# EAGLE design led_pcb (EAGLE 9.1.2)
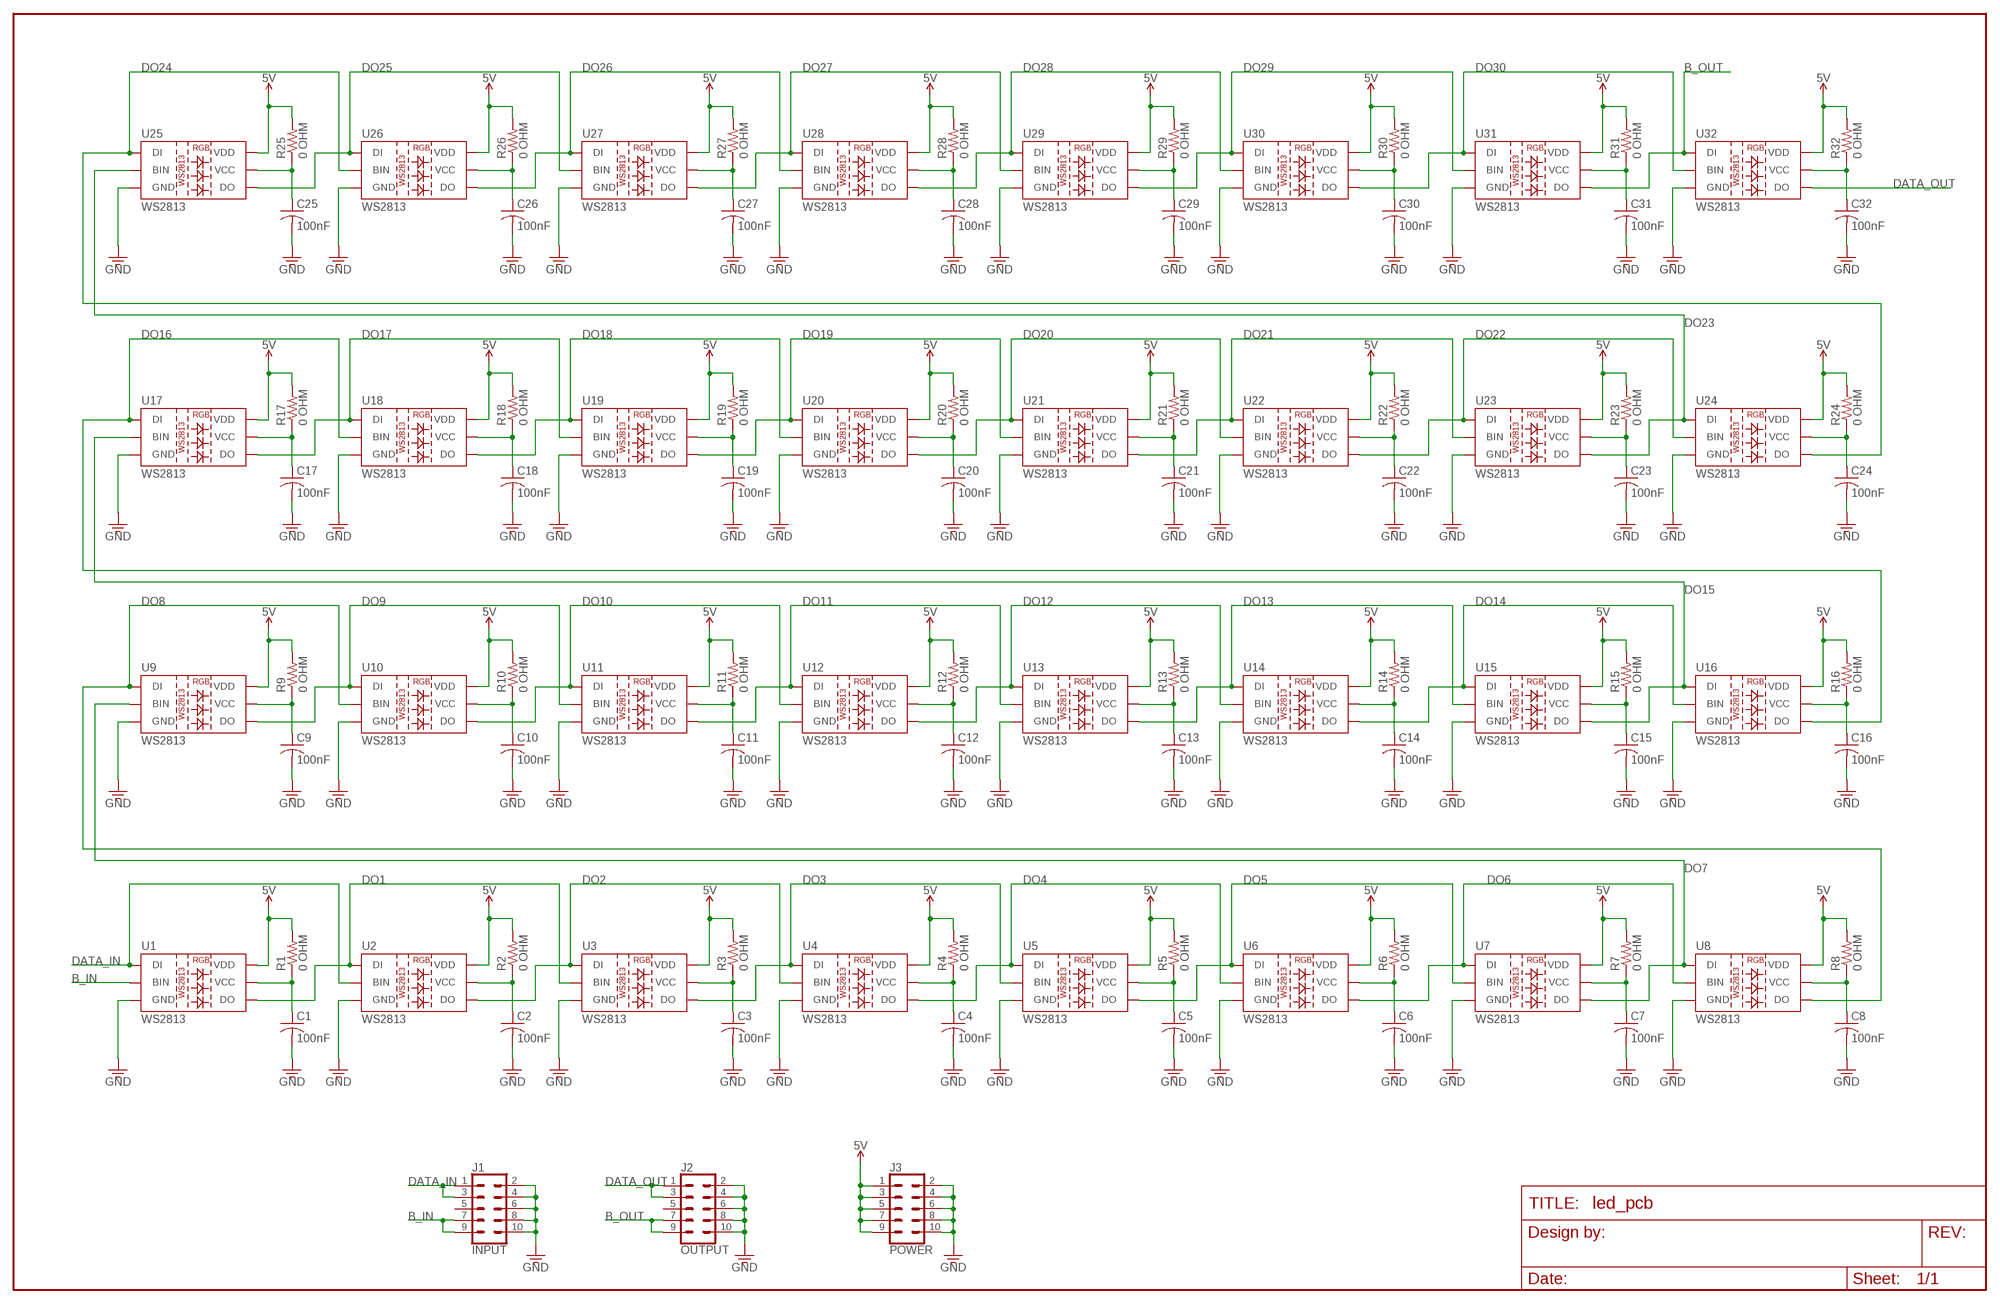
[diagram p0: schematic, sheet 1]

## Parts
C1  100nF  C-USC0805K  [C0805K]
C2  100nF  C-USC0805K  [C0805K]
C3  100nF  C-USC0805K  [C0805K]
C4  100nF  C-USC0805K  [C0805K]
C5  100nF  C-USC0805K  [C0805K]
C6  100nF  C-USC0805K  [C0805K]
C7  100nF  C-USC0805K  [C0805K]
C8  100nF  C-USC0805K  [C0805K]
C9  100nF  C-USC0805K  [C0805K]
C10  100nF  C-USC0805K  [C0805K]
C11  100nF  C-USC0805K  [C0805K]
C12  100nF  C-USC0805K  [C0805K]
C13  100nF  C-USC0805K  [C0805K]
C14  100nF  C-USC0805K  [C0805K]
C15  100nF  C-USC0805K  [C0805K]
C16  100nF  C-USC0805K  [C0805K]
C17  100nF  C-USC0805K  [C0805K]
C18  100nF  C-USC0805K  [C0805K]
C19  100nF  C-USC0805K  [C0805K]
C20  100nF  C-USC0805K  [C0805K]
C21  100nF  C-USC0805K  [C0805K]
C22  100nF  C-USC0805K  [C0805K]
C23  100nF  C-USC0805K  [C0805K]
C24  100nF  C-USC0805K  [C0805K]
C25  100nF  C-USC0805K  [C0805K]
C26  100nF  C-USC0805K  [C0805K]
C27  100nF  C-USC0805K  [C0805K]
C28  100nF  C-USC0805K  [C0805K]
C29  100nF  C-USC0805K  [C0805K]
C30  100nF  C-USC0805K  [C0805K]
C31  100nF  C-USC0805K  [C0805K]
C32  100nF  C-USC0805K  [C0805K]
J1  INPUT  CONN_05X2SHD_SMD  [2X5-SHROUDED_SMD]
J2  OUTPUT  CONN_05X2SHD_SMD  [2X5-SHROUDED_SMD]
J3  POWER  CONN_05X2SHD_SMD  [2X5-SHROUDED_SMD]
R1  0 OHM  R-US_M0805  [M0805]
R2  0 OHM  R-US_M0805  [M0805]
R3  0 OHM  R-US_M0805  [M0805]
R4  0 OHM  R-US_M0805  [M0805]
R5  0 OHM  R-US_M0805  [M0805]
R6  0 OHM  R-US_M0805  [M0805]
R7  0 OHM  R-US_M0805  [M0805]
R8  0 OHM  R-US_M0805  [M0805]
R9  0 OHM  R-US_M0805  [M0805]
R10  0 OHM  R-US_M0805  [M0805]
R11  0 OHM  R-US_M0805  [M0805]
R12  0 OHM  R-US_M0805  [M0805]
R13  0 OHM  R-US_M0805  [M0805]
R14  0 OHM  R-US_M0805  [M0805]
R15  0 OHM  R-US_M0805  [M0805]
R16  0 OHM  R-US_M0805  [M0805]
R17  0 OHM  R-US_M0805  [M0805]
R18  0 OHM  R-US_M0805  [M0805]
R19  0 OHM  R-US_M0805  [M0805]
R20  0 OHM  R-US_M0805  [M0805]
R21  0 OHM  R-US_M0805  [M0805]
R22  0 OHM  R-US_M0805  [M0805]
R23  0 OHM  R-US_M0805  [M0805]
R24  0 OHM  R-US_M0805  [M0805]
R25  0 OHM  R-US_M0805  [M0805]
R26  0 OHM  R-US_M0805  [M0805]
R27  0 OHM  R-US_M0805  [M0805]
R28  0 OHM  R-US_M0805  [M0805]
R29  0 OHM  R-US_M0805  [M0805]
R30  0 OHM  R-US_M0805  [M0805]
R31  0 OHM  R-US_M0805  [M0805]
R32  0 OHM  R-US_M0805  [M0805]
U1  WS2813  [WS2813]
U2  WS2813  [WS2813]
U3  WS2813  [WS2813]
U4  WS2813  [WS2813]
U5  WS2813  [WS2813]
U6  WS2813  [WS2813]
U7  WS2813  [WS2813]
U8  WS2813  [WS2813]
U9  WS2813  [WS2813]
U10  WS2813  [WS2813]
U11  WS2813  [WS2813]
U12  WS2813  [WS2813]
U13  WS2813  [WS2813]
U14  WS2813  [WS2813]
U15  WS2813  [WS2813]
U16  WS2813  [WS2813]
U17  WS2813  [WS2813]
U18  WS2813  [WS2813]
U19  WS2813  [WS2813]
U20  WS2813  [WS2813]
U21  WS2813  [WS2813]
U22  WS2813  [WS2813]
U23  WS2813  [WS2813]
U24  WS2813  [WS2813]
U25  WS2813  [WS2813]
U26  WS2813  [WS2813]
U27  WS2813  [WS2813]
U28  WS2813  [WS2813]
U29  WS2813  [WS2813]
U30  WS2813  [WS2813]
U31  WS2813  [WS2813]
U32  WS2813  [WS2813]

## Nets
5V: J3.1 J3.3 J3.5 J3.7 J3.9 R1.2 R2.2 R3.2 R4.2 R5.2 R6.2 R7.2 R8.2 R9.2 R10.2 R11.2 R12.2 R13.2 R14.2 R15.2 R16.2 R17.2 R18.2 R19.2 R20.2 R21.2 R22.2 R23.2 R24.2 R25.2 R26.2 R27.2 R28.2 R29.2 R30.2 R31.2 R32.2 U1.2(VDD) U2.2(VDD) U3.2(VDD) U4.2(VDD) U5.2(VDD) U6.2(VDD) U7.2(VDD) U8.2(VDD) U9.2(VDD) U10.2(VDD) U11.2(VDD) U12.2(VDD) U13.2(VDD) U14.2(VDD) U15.2(VDD) U16.2(VDD) U17.2(VDD) U18.2(VDD) U19.2(VDD) U20.2(VDD) U21.2(VDD) U22.2(VDD) U23.2(VDD) U24.2(VDD) U25.2(VDD) U26.2(VDD) U27.2(VDD) U28.2(VDD) U29.2(VDD) U30.2(VDD) U31.2(VDD) U32.2(VDD)
B_IN: J1.7 J1.9 U1.6(BIN)
B_OUT: J2.7 J2.9 U31.3(DO) U32.4(DI)
DATA_IN: J1.1 J1.3 U1.4(DI) U2.6(BIN)
DATA_OUT: J2.1 J2.3 U32.3(DO)
DO1: U1.3(DO) U2.4(DI) U3.6(BIN)
DO2: U2.3(DO) U3.4(DI) U4.6(BIN)
DO3: U3.3(DO) U4.4(DI) U5.6(BIN)
DO4: U4.3(DO) U5.4(DI) U6.6(BIN)
DO5: U5.3(DO) U6.4(DI) U7.6(BIN)
DO6: U6.3(DO) U7.4(DI) U8.6(BIN)
DO7: U7.3(DO) U8.4(DI) U9.6(BIN)
DO8: U8.3(DO) U9.4(DI) U10.6(BIN)
DO9: U9.3(DO) U10.4(DI) U11.6(BIN)
DO10: U10.3(DO) U11.4(DI) U12.6(BIN)
DO11: U11.3(DO) U12.4(DI) U13.6(BIN)
DO12: U12.3(DO) U13.4(DI) U14.6(BIN)
DO13: U13.3(DO) U14.4(DI) U15.6(BIN)
DO14: U14.3(DO) U15.4(DI) U16.6(BIN)
DO15: U15.3(DO) U16.4(DI) U17.6(BIN)
DO16: U16.3(DO) U17.4(DI) U18.6(BIN)
DO17: U17.3(DO) U18.4(DI) U19.6(BIN)
DO18: U18.3(DO) U19.4(DI) U20.6(BIN)
DO19: U19.3(DO) U20.4(DI) U21.6(BIN)
DO20: U20.3(DO) U21.4(DI) U22.6(BIN)
DO21: U21.3(DO) U22.4(DI) U23.6(BIN)
DO22: U22.3(DO) U23.4(DI) U24.6(BIN)
DO23: U23.3(DO) U24.4(DI) U25.6(BIN)
DO24: U24.3(DO) U25.4(DI) U26.6(BIN)
DO25: U25.3(DO) U26.4(DI) U27.6(BIN)
DO26: U26.3(DO) U27.4(DI) U28.6(BIN)
DO27: U27.3(DO) U28.4(DI) U29.6(BIN)
DO28: U28.3(DO) U29.4(DI) U30.6(BIN)
DO29: U29.3(DO) U30.4(DI) U31.6(BIN)
DO30: U30.3(DO) U31.4(DI) U32.6(BIN)
GND: C1.2 C2.2 C3.2 C4.2 C5.2 C6.2 C7.2 C8.2 C9.2 C10.2 C11.2 C12.2 C13.2 C14.2 C15.2 C16.2 C17.2 C18.2 C19.2 C20.2 C21.2 C22.2 C23.2 C24.2 C25.2 C26.2 C27.2 C28.2 C29.2 C30.2 C31.2 C32.2 J1.2 J1.4 J1.6 J1.8 J1.10 J2.2 J2.4 J2.6 J2.8 J2.10 J3.2 J3.4 J3.6 J3.8 J3.10 U1.5(GND) U2.5(GND) U3.5(GND) U4.5(GND) U5.5(GND) U6.5(GND) U7.5(GND) U8.5(GND) U9.5(GND) U10.5(GND) U11.5(GND) U12.5(GND) U13.5(GND) U14.5(GND) U15.5(GND) U16.5(GND) U17.5(GND) U18.5(GND) U19.5(GND) U20.5(GND) U21.5(GND) U22.5(GND) U23.5(GND) U24.5(GND) U25.5(GND) U26.5(GND) U27.5(GND) U28.5(GND) U29.5(GND) U30.5(GND) U31.5(GND) U32.5(GND)
N$1: C1.1 R1.1 U1.1(VCC)
N$3: C2.1 R2.1 U2.1(VCC)
N$5: C3.1 R3.1 U3.1(VCC)
N$7: C4.1 R4.1 U4.1(VCC)
N$9: C5.1 R5.1 U5.1(VCC)
N$11: C6.1 R6.1 U6.1(VCC)
N$13: C7.1 R7.1 U7.1(VCC)
N$15: C8.1 R8.1 U8.1(VCC)
N$18: C17.1 R17.1 U17.1(VCC)
N$19: C18.1 R18.1 U18.1(VCC)
N$21: C19.1 R19.1 U19.1(VCC)
N$23: C9.1 R9.1 U9.1(VCC)
N$24: C10.1 R10.1 U10.1(VCC)
N$26: C11.1 R11.1 U11.1(VCC)
N$28: C12.1 R12.1 U12.1(VCC)
N$30: C13.1 R13.1 U13.1(VCC)
N$32: C14.1 R14.1 U14.1(VCC)
N$34: C15.1 R15.1 U15.1(VCC)
N$36: C16.1 R16.1 U16.1(VCC)
N$38: C20.1 R20.1 U20.1(VCC)
N$40: C21.1 R21.1 U21.1(VCC)
N$42: C22.1 R22.1 U22.1(VCC)
N$44: C23.1 R23.1 U23.1(VCC)
N$46: C24.1 R24.1 U24.1(VCC)
N$48: C25.1 R25.1 U25.1(VCC)
N$49: C26.1 R26.1 U26.1(VCC)
N$51: C27.1 R27.1 U27.1(VCC)
N$53: C28.1 R28.1 U28.1(VCC)
N$55: C29.1 R29.1 U29.1(VCC)
N$57: C30.1 R30.1 U30.1(VCC)
N$59: C31.1 R31.1 U31.1(VCC)
N$61: C32.1 R32.1 U32.1(VCC)
Unconnected: J1.5 J2.5

## Library data of the parts
C1-C32 = rcl:C-US: CAPACITOR, American symbol; SPICEPREFIX: C
J1-J3 = kala_lib:CONN_05X2: Multi connection point. Often used as Generic Header-pin footprint for 0.1 inch spaced/style header connections For AVR SPI programming port, see special device with nice symbol: "AVR_SPI_PROG_5x2.dev" You can populate with any combo of single row headers, but if you'd like an exact match, check these: 2x5 AVR ICSP Male Header <https://www.sparkfun.com/products/778> (PRT-00778) 2x5 Pin Shrouded Header <https://www.sparkfun.com/products/8506> (PRT-08506) On any of the 0.1 inch spaced packages, you can populate with these: Break Away Headers - Straight <https://www.sparkfun.com/products/116> (PRT-00116) Break Away Male Headers - Right Angle <https://www.sparkfun.com/products/553> (PRT-00553) Female Headers <https://www.sparkfun.com/products/115> (PRT-00115) Break Away Headers - Machine Pin <https://www.sparkfun.com/products/117> (PRT-00117) Break Away Female Headers - Swiss Machine Pin <https://www.sparkfun.com/products/743> (PRT-00743) Special note: the shrouded connector mates well with our 5x2 ribbon cables: 2x5 Pin IDC Ribbon Cable <https://www.sparkfun.com/products/8535> (PRT-08535); PROD_ID: CONN-09508
R1-R32 = resistor:R-US_: RESISTOR, American symbol
U1-U32 = kala_lib:WS2813: WS2813 RGB LED

## Board
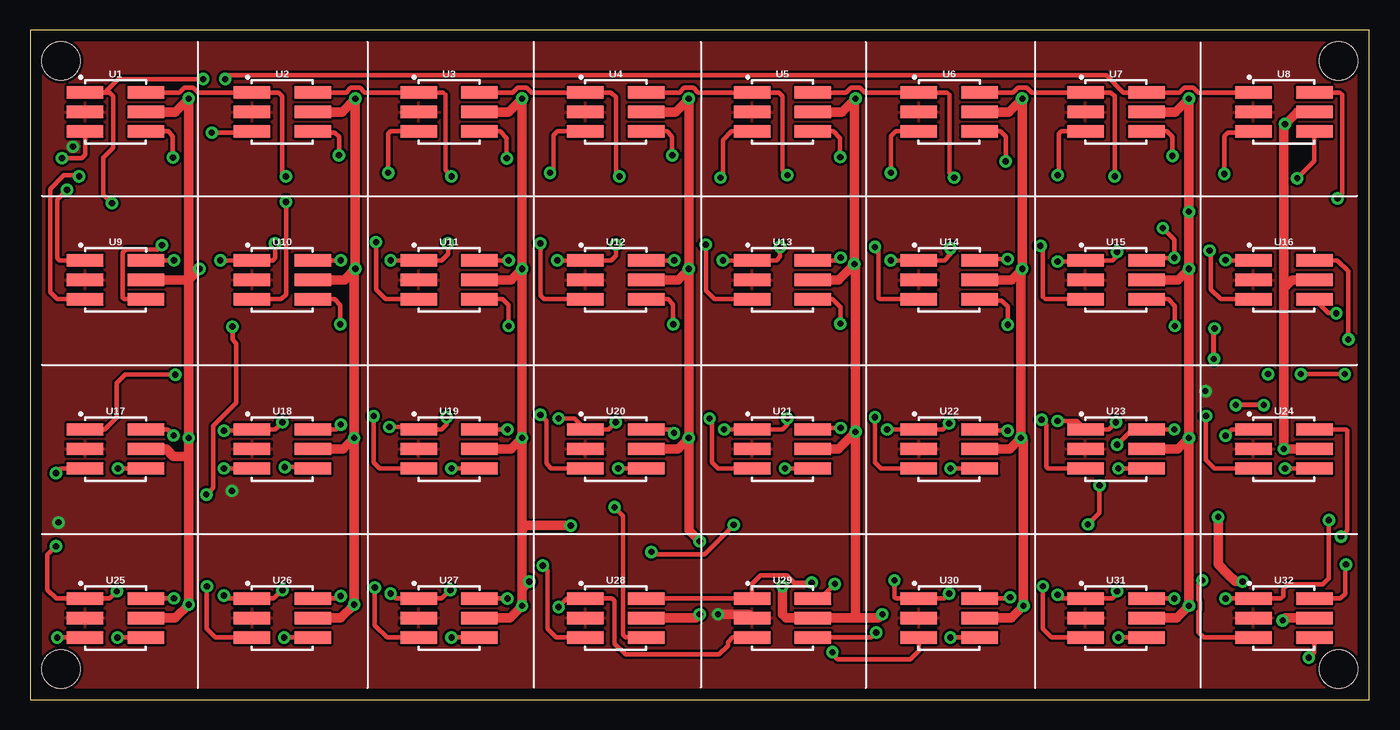
[diagram p1: board, top side]
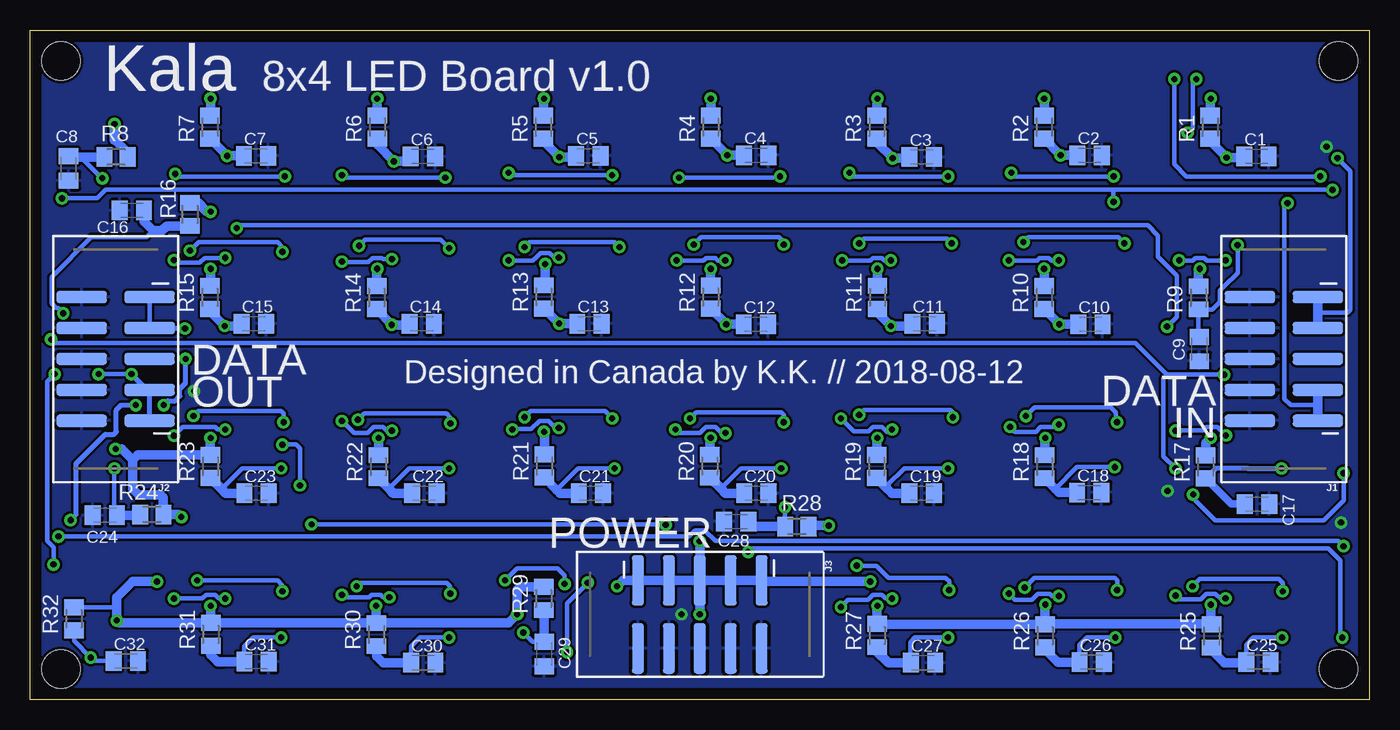
[diagram p2: board, bottom side, seen from below]

Size 110 x 55 mm. Coordinates in mm from the lower left corner, seen from the top.
Outline: 0,0 110,0 110,55 0,55 0,0
Copper layers (1*16): Top 0.035mm / dielectric 1.5mm / Bottom 0.035mm
Design rules "kala": minimum track width 8mil, minimum drill 20mil, track to track 8mil, track to pad 8mil, pad to pad 8mil, via to via 8mil, smd to smd 8mil, copper to edge 10mil, drill to drill 8mil, minimum pad ring 12mil, minimum via ring 10mil, stop-mask expansion 4mil, vias tented up to drill 25mil, thermal gap 10mil
Holes 3.15 mm at 2.5,52.5 107.5,52.5 107.5,2.5 2.5,2.5

### Footprints (pad centres in the part's own frame; a part is rotated, then mirrored left to right if it is on the bottom)
C0805K = smd 1.3 x 1.6: 1 -1,0; 2 1,0
2X5-SHROUDED_SMD = smd 4.15 x 1: 1 -2.794,5.08; 2 2.794,5.08; 3 -2.794,2.54; 4 2.794,2.54; 5 -2.794,0; 6 2.794,0; 7 -2.794,-2.54; 8 2.794,-2.54; 9 -2.794,-5.08; 10 2.794,-5.08
M0805 = smd 1.3 x 1.6: 1 -0.95,0; 2 0.95,0
WS2813 = smd 3 x 1: 1 2.5,-1.6; 2 2.5,-0.001; 3 2.5,1.6; 4 -2.5,1.6; 5 -2.5,-0.001; 6 -2.5,-1.6

### Placement (x,y rotation side)
C1  9.26,44.65 0 bottom
C2  22.96,44.74 0 bottom
C3  36.76,44.59 0 bottom
C4  50.36,44.74 0 bottom
C5  64.16,44.69 0 bottom
C6  77.76,44.64 0 bottom
C7  91.46,44.69 0 bottom
C8  106.86,43.66 270 bottom
C9  13.95,28.81 270 bottom
C10  22.9,30.85 0 bottom
C11  36.52,30.9 0 bottom
C12  50.39,30.85 0 bottom
C13  64.06,30.9 0 bottom
C14  77.85,30.9 0 bottom
C15  91.64,30.9 0 bottom
C16  101.67,40.2 180 bottom
C17  9.2,16.06 0 bottom
C18  22.99,17.01 0 bottom
C19  36.76,16.96 0 bottom
C20  50.35,16.96 0 bottom
C21  63.94,16.96 0 bottom
C22  77.63,16.96 0 bottom
C23  91.42,16.96 0 bottom
C24  103.89,15.14 180 bottom
C25  9.1,3.07 0 bottom
C26  22.79,3.07 0 bottom
C27  36.66,3.02 0 bottom
C28  52,14.63 180 bottom
C29  67.78,3.74 270 bottom
C30  77.73,3.02 0 bottom
C31  91.42,3.12 0 bottom
C32  102.16,3.17 0 bottom
J1  7,28 180 bottom
J2  103,28 180 bottom
J3  55,7 270 bottom
R1  13.05,47.04 90 bottom
R2  26.7,47.04 90 bottom
R3  40.44,47.04 90 bottom
R4  54.09,47.04 90 bottom
R5  67.84,47.04 90 bottom
R6  81.49,47.04 90 bottom
R7  95.24,47.04 90 bottom
R8  102.96,44.59 0 bottom
R9  14.02,33.02 90 bottom
R10  26.7,33.04 90 bottom
R11  40.4,33.06 90 bottom
R12  54.1,33.08 90 bottom
R13  67.8,33.1 90 bottom
R14  81.55,33.04 90 bottom
R15  95.25,33.06 90 bottom
R16  96.9,39.88 90 bottom
R17  13.43,19.12 90 bottom
R18  26.66,19.14 90 bottom
R19  40.46,19.16 90 bottom
R20  54.16,19.18 90 bottom
R21  67.76,19.2 90 bottom
R22  81.41,19.14 90 bottom
R23  95.21,19.16 90 bottom
R24  100.02,15.21 0 bottom
R25  12.94,5.22 90 bottom
R26  26.62,5.24 90 bottom
R27  40.42,5.26 90 bottom
R28  47.02,14.22 0 bottom
R29  67.82,8.3 90 bottom
R30  81.57,5.34 90 bottom
R31  95.17,5.36 90 bottom
R32  106.42,6.63 90 bottom
U1  7,48.3 0 top
U2  20.7,48.3 0 top
U3  34.4,48.3 0 top
U4  48.1,48.3 0 top
U5  61.8,48.3 0 top
U6  75.5,48.3 0 top
U7  89.2,48.3 0 top
U8  103,48.3 0 top
U9  7,34.5 0 top
U10  20.7,34.5 0 top
U11  34.4,34.5 0 top
U12  48.1,34.5 0 top
U13  61.8,34.5 0 top
U14  75.5,34.5 0 top
U15  89.2,34.5 0 top
U16  103,34.5 0 top
U17  7,20.6 0 top
U18  20.7,20.6 0 top
U19  34.4,20.6 0 top
U20  48.1,20.6 0 top
U21  61.8,20.6 0 top
U22  75.5,20.6 0 top
U23  89.2,20.6 0 top
U24  103,20.6 0 top
U25  7,6.7 0 top
U26  20.7,6.7 0 top
U27  34.4,6.7 0 top
U28  48.1,6.7 0 top
U29  61.8,6.7 0 top
U30  75.5,6.7 0 top
U31  89.2,6.7 0 top
U32  103,6.7 0 top

### Tracks (layer width: path | path; a pad name or v marks a point on that pad's centre or on a via)
5V  (via drill 0.51)
  Top 0.762: U26.2 25.5,6.7 v26.6,7.8 v26.6,21.5 | U27.2 39.4,6.7 v40.4,7.7 40.4,9.1 | U25.2 11.9,6.7 v13,7.8 13,20 | U28.2 54.7,6.7 v55,7 | 40.4,9.1 v41,9.7 | U18.2 25.7,20.6 v26.6,21.5 | U19.2 39.5,20.6 v40.4,21.5 | U20.2 53.2,20.6 v54.1,21.5 | U21.2 66.4,20.6 v67.8,22 | U22.2 80.5,20.6 v81.4,21.5 | U23.2 94.3,20.6 v95.2,21.5 | 68,6.7 U29.2 62.1,6.7 61.8,7 v61.8,9.3 | 68,6.7 69.7,6.7 v70,7 | U30.2 80.6,6.7 v81.6,7.7 81.6,21.3 v81.4,21.5 | U31.2 94.2,6.7 v95.2,7.7 v95.2,21.5 | v102.9,6.5 103.1,6.7 U32.2 | 13,20 v13,21.5 13,34.5 | U9.2 13,34.5 | 13,34.5 v13.9,35.4 | U10.2 25.8,34.5 v26.7,35.4 | U11.2 39.5,34.5 v40.4,35.4 | U12.2 53.2,34.5 v54.1,35.4 | U13.2 66.4,34.5 v67.7,35.8 | U14.2 80.6,34.5 v81.5,35.4 | U15.2 94.3,34.5 v95.2,35.4 | U1.2 11.9,48.3 v13,49.4 13,34.5 | U2.2 25.6,48.3 v26.7,49.4 v26.7,35.4 | U3.2 39.3,48.3 v40.4,49.4 v40.4,35.4 | U4.2 53,48.3 v54.1,49.4 v54.1,35.4 | U5.2 66.7,48.3 v67.8,49.4 67.7,49.3 v67.7,35.8 | U6.2 80.4,48.3 v81.5,49.4 v81.5,35.4 | U7.2 94.1,48.3 v95.2,49.4 v95.2,40.1 v95.2,35.4 | U8.2 104.1,48.3 v103.1,47.3 103,47.2 103,33.8 | v26.6,21.5 26.6,35.3 v26.7,35.4 | v40.4,21.5 v40.4,35.4 | 40.4,9.1 40.4,14 | 40.4,14 v40.4,21.5 | v55,13 54.1,13.9 v54.1,21.5 | v54.1,21.5 v54.1,35.4 | v67.8,22 67.8,6.9 68,6.7 | v67.8,22 67.8,35.7 v67.7,35.8 | v81.4,21.5 81.4,35.3 v81.5,35.4 | v95.2,21.5 v95.2,35.4 | 40.4,14 40.7,14.3 v44.4,14.3 | U24.2 v103,20.6 103,33.8 | v97.6,15 97.6,11.1 98.4,10.3 99,9.7 v99.6,9.7 | U16.2 103.7,34.5 103,33.8 | 13,20 11.75,20 11.15,20.6 U17.2
  Bottom 0.381: R32.2 102.97,7.58 102.9,7.65
  Bottom 0.762: J3.5 J3.3 J3.1 49.83,9.7 v41,9.7 | J3.5 J3.7 J3.9 61.31,9.79 v61.8,9.3 | 13,6.23 R25.2 | v26.6,7.8 26.62,7.78 R26.2 | v40.4,7.7 40.42,7.68 R27.2 40.4,6.19 R26.2 | v13,7.8 13,6.23 | 13,6.23 26.58,6.23 R26.2 | v55,7 J3.5 | R17.2 13.43,21.07 v13,21.5 | v26.6,21.5 26.66,21.44 R18.2 | v40.4,21.5 40.46,21.44 R19.2 | v54.1,21.5 54.16,21.44 R20.2 | v67.8,22 67.76,21.96 R21.2 | v81.4,21.5 R22.2 | v95.2,21.5 v95.21,21.49 R23.2 101.19,20.11 101.6,19.7 | R29.2 69.75,9.25 70,9 v70,7 70.7,6.3 R30.2 | v81.6,7.7 81.6,6.32 R30.2 | R30.2 95.15,6.29 R31.2 | v95.2,7.7 95.17,7.67 R31.2 | R31.2 102.71,6.31 v102.9,6.5 102.9,7.65 102.9,8.4 101.6,9.7 v99.6,9.7 | v13.9,35.4 14.02,35.28 R9.2 | v26.7,35.4 R10.2 | v40.4,35.4 R11.2 | v54.1,35.4 R12.2 | v67.7,35.8 67.7,34.15 R13.2 | v81.5,35.4 81.55,35.35 R14.2 | v95.2,35.4 95.2,34.06 R15.2 | v13,49.4 13.05,49.35 R1.2 | v26.7,49.4 R2.2 | v40.4,49.4 40.44,49.36 R3.2 | v54.1,49.4 v54.09,49.39 R4.2 | v67.8,49.4 67.84,49.36 R5.2 | v81.5,49.4 R6.2 | v95.2,49.4 95.2,48.03 R7.2 | R8.2 102.01,44.97 103.02,45.97 103.07,45.97 103.1,46 v103.1,47.3 | J3.5 v55,13 | v44.4,14.3 45.99,14.3 R28.2 | v103,20.6 102.5,20.6 101.6,19.7 | 101.6,19.7 101.6,17.3 101.1,16.8 99.3,16.8 99.1,16.6 99.1,15.24 R24.2 97.81,15.21 v97.6,15 | v95.2,40.1 95.5,40.1 96.23,40.83 R16.2
B_IN  (via drill 0.51)
  Top 0.381: v2.6,44.5 4.2,44.5 4.5,44.8 U1.6
  Bottom 0.381: v2.6,44.5 1.55,43.45 1.55,32 1.75,31.8 4.01,31.8 4.21,32
  Bottom 0.762: J1.7 4.21,32 J1.9
B_OUT  (via drill 0.51)
  Top 0.381: U31.3 v94,8.3 | v98.2,8.3 U32.4 102.75,8.3 102.95,8.5 102.95,9.1 103.3,9.45 106.2,9.45 106.7,9.95 v106.7,14.75
  Top 0.406: v101.35,24.2 v99.05,24.2 | v97.25,28 97.25,30.45 v97.3,30.5
  Bottom 0.381: v94,8.3 94.53,8.3 94.83,8.6 95.57,8.6 95.88,8.3 v98.2,8.3 | J2.9 100.21,32 J2.7 | 106.25,15.2 v106.7,14.75
  Bottom 0.406: 106.25,15.2 106.25,19.4 103.85,21.8 103.15,21.8 102.95,22 102.95,23.8 102.55,24.2 v101.35,24.2 | v97.25,28 97.25,26 97.72,25.52 97.72,24.94 98.11,24.55 98.7,24.55 v99.05,24.2 | v97.3,30.5 100.17,30.5 J2.7
DATA_IN  (via drill 0.51)
  Top 0.381: U1.4 5.45,49.9 | 5.45,49.9 6.1,49.9 7.2,51 v14.2,51 | v14.9,46.6 18.1,46.6 U2.6 | v6.7,40.8 6,41.5 6,44.55 6.8,45.35 6.8,49.6 6.5,49.9 5.45,49.9
  Bottom 0.381: v14.2,51 14.5,50.7 14.5,47 v14.9,46.6 | v6.7,40.8 6.95,40.55 6.95,33.35 6.95,24.7 6.45,24.2 4.2,24.2 4.21,24.21 | 4.21,24.21 J1.3 | J1.1 4.21,24.21
  Bottom 0.762: J1.1 J1.3
DATA_OUT  (via drill 0.51)
  Top 0.381: U32.3 107.65,8.3 108.05,8.7 108.05,11.05 v108.1,11.1 | v104.4,26.75 v108,26.75
  Bottom 0.381: v108.1,11.1 108.1,12.53 108.6,13.03 108.6,26.15 v108,26.75 | v101.7,26.75 v104.4,26.75
  Bottom 0.406: v101.7,26.75 100.41,25.46 J2.3 J2.1
DO1  (via drill 0.51)
  Top 0.381: U1.3 12.22,49.9 12.63,50.3 13.37,50.3 13.78,49.9 U2.4 20.4,49.9 20.7,49.6 20.7,43.3 v21,43 | v29.4,43.3 29.4,46.5 29.6,46.7 U3.6
  Bottom 0.381: v21,43 29.1,43 v29.4,43.3
DO2  (via drill 0.51)
  Top 0.381: U2.3 25.93,49.9 26.33,50.3 27.07,50.3 27.48,49.9 U3.4 33.9,49.9 34.1,49.7 34.1,43.5 v34.6,43 | v42.7,43.3 43,43.6 43,46.4 43.3,46.7 U4.6
  Bottom 0.381: v34.6,43 42.4,43 v42.7,43.3
DO3  (via drill 0.51)
  Top 0.381: U3.3 39.62,49.9 40.03,50.3 40.77,50.3 41.17,49.9 U4.4 47.7,49.9 48.1,49.5 48.1,43.3 v48.4,43 | v56.7,42.9 56.9,43.1 56.9,46 57.6,46.7 U5.6
  Bottom 0.381: v48.4,43 48.5,42.9 v56.7,42.9
DO4  (via drill 0.51)
  Top 0.381: U4.3 53.33,49.9 53.73,50.3 54.47,50.3 54.88,49.9 U5.4 61.5,49.9 61.8,49.6 61.8,43.5 v62.2,43.1 | v70.7,43.3 70.7,46.3 71.1,46.7 U6.6
  Bottom 0.381: v62.2,43.1 70.5,43.1 v70.7,43.3
DO5  (via drill 0.51)
  Top 0.381: U5.3 67.03,49.9 67.43,50.3 68.17,50.3 68.58,49.9 U6.4 75.3,49.9 75.5,49.7 75.5,43.3 v75.9,42.9 | v84.4,43.1 84.5,43.2 84.5,46.5 84.7,46.7 U7.6
  Bottom 0.381: v75.9,42.9 84.2,42.9 v84.4,43.1
DO6  (via drill 0.51)
  Top 0.381: U6.3 80.72,49.9 81.13,50.3 81.87,50.3 82.28,49.9 U7.4 88.8,49.9 89.1,49.6 v89.1,43 | v98.1,43.2 98.1,46.3 98.4,46.6 100.4,46.6 U8.6
  Bottom 0.381: v89.1,43 97.9,43 v98.1,43.2
DO7  (via drill 0.51)
  Top 0.381: U7.3 94.42,49.9 94.83,50.3 95.57,50.3 95.97,49.9 U8.4 | U7.3 | U7.3 89.8,49.9 88.4,51.3 16.3,51.3 v16,51 | U9.6 2.2,32.9 1.62,33.48 1.62,41.97 2.75,43.1 3.9,43.1 v4,43
  Bottom 0.381: v4,43 15,43 16,44 v16,51
DO8  (via drill 0.51)
  Top 0.381: U8.3 107.6,49.9 107.8,49.7 107.8,41.6 v107.4,41.2 | v3,41.9 2.2,41.1 2.2,36.3 2.4,36.1 U9.4 | v21,40.9 21,33.3 20.6,32.9 U10.6
  Bottom 0.381: v107.4,41.2 104.5,41.2 103.8,41.9 21,41.9 | 21,41.9 v3,41.9 | 21,41.9 v21,40.9
DO9  (via drill 0.51)
  Top 0.381: U9.3 v11.8,36.1 | v15.6,36.1 U10.4 19.9,36.1 20.1,36.3 v20.1,37.5 | v28.4,37.6 28.4,33.7 29.2,32.9 U11.6
  Bottom 0.381: v11.8,36.1 13.32,36.1 13.53,36.3 14.27,36.3 14.47,36.1 v15.6,36.1 | v20.1,37.5 20.6,38 28,38 v28.4,37.6
DO10  (via drill 0.51)
  Top 0.381: U10.3 v25.5,36.1 | v29.6,36.1 U11.4 33.8,36.1 34.3,36.6 v34.3,37.5 | v41.9,37.5 41.9,33.2 42.2,32.9 U12.6
  Bottom 0.381: v25.5,36.1 26.12,36.1 26.33,36.3 27.07,36.3 27.27,36.1 v29.6,36.1 | v34.3,37.5 34.7,37.9 41.5,37.9 v41.9,37.5
DO11  (via drill 0.51)
  Top 0.381: U11.3 v39.3,36.1 | v43.3,36.1 U12.4 47.7,36.1 48.1,36.5 v48.1,37.4 | v55.5,37.4 55.5,33.6 56.2,32.9 U13.6
  Bottom 0.381: v39.3,36.1 39.83,36.1 40.03,36.3 40.77,36.3 40.98,36.1 v43.3,36.1 | v48.1,37.4 48.1,37.6 48.5,38 54.9,38 v55.5,37.4
DO12  (via drill 0.51)
  Top 0.381: U12.3 v52.9,36.1 | v56.9,36.1 U13.4 61.3,36.1 61.6,36.4 v61.6,37.2 | v69.4,37.2 69.7,36.9 69.7,34.58 69.7,34.57 69.7,33.83 69.7,33 69.8,32.9 U14.6
  Bottom 0.381: v52.9,36.1 53.52,36.1 53.73,36.3 54.47,36.3 54.67,36.1 v56.9,36.1 | v61.6,37.2 62,37.6 69,37.6 v69.4,37.2
DO13  (via drill 0.51)
  Top 0.381: U13.3 66.36,36.1 v66.58,36.32 | v70.7,36.1 U14.4 75.1,36.1 75.6,36.6 v75.6,37.1 | v83,37.3 83.2,37.1 83.2,33.1 83.4,32.9 U15.6
  Bottom 0.381: v66.58,36.32 66.95,36.32 67.33,36.7 68.07,36.7 68.58,36.2 68.6,36.2 68.7,36.1 v70.7,36.1 | v75.6,37.1 76.3,37.8 82.5,37.8 v83,37.3
DO14  (via drill 0.51)
  Top 0.381: v80.3,36.2 78.1,36.2 U14.3 | v84.4,36 86.6,36 U15.4 88.9,36.1 89.3,36.5 v89.3,36.8 | v96.9,36.9 97,36.8 97,33.7 97.8,32.9 U16.6
  Bottom 0.381: v80.3,36.2 81.03,36.2 81.13,36.3 81.87,36.3 82.24,35.94 84.34,35.94 v84.4,36 | v89.3,36.8 89.3,37.2 89.7,37.6 96.17,37.6 96.29,37.49 96.31,37.49 v96.9,36.9
DO15  (via drill 0.51)
  Top 0.381: v98.2,36.12 98.22,36.1 U16.4 | U15.3 91.9,36.3 v94,36.3 94,37.8 v93.05,38.75 | v16.6,30.65 16.6,29.57 16.9,29.27 16.9,24.38 15,22.47 15,17.4 v14.45,16.85 | v2.1,18.6 2.5,19 U17.6
  Bottom 0.381: v94,36.3 94.83,36.3 95.7,36.3 96.1,35.9 97.98,35.9 v98.2,36.12 | v93.05,38.75 92.8,39 81,39 | 81,39 | 81,39 18.2,39 17.35,38.15 17.35,36.4 15.8,34.85 15.8,34.1 15.8,31.45 v16.6,30.65 | v2.1,18.6 2.1,16.35 3.73,14.72 12.62,14.72 14.45,16.54 v14.45,16.85
DO16  (via drill 0.51)
  Top 0.381: U16.3 107.4,36.1 108.3,35.2 v108.3,29.6 | v11.91,26.7 7.8,26.7 7.1,26 7.1,23.2 6.1,22.2 U17.4 | v15.9,19 U18.6
  Bottom 0.381: v108.3,29.6 108,29.3 20.35,29.3 19.2,29.3 16.6,26.7 | v11.91,26.7 16.6,26.7 | v15.9,19 16.9,20 16.9,26.4 16.6,26.7
DO17  (via drill 0.51)
  Top 0.381: U17.3 11.27,22.2 v11.76,21.71 | v15.9,22.1 18.1,22.1 U18.4 20.1,22.2 v20.7,22.8 | v28.2,23.3 28.2,19.5 28.7,19 U19.6
  Bottom 0.381: v15.9,22.1 13.68,22.1 13.37,22.4 12.46,22.4 v11.76,21.71 | v20.7,22.8 20.8,22.9 20.8,23.6 21.2,24 27.5,24 v28.2,23.3
DO18  (via drill 0.51)
  Top 0.381: U18.3 25.1,22.2 v25.5,22.6 | v29.5,22.4 31.7,22.4 U19.4 33.8,22.2 34.2,22.6 v34.2,23.2 | v41.9,23.4 42.4,22.9 42.4,20.77 42.4,20.03 42.4,20.02 42.4,19.4 42.8,19 U20.6
  Bottom 0.381: v29.5,22.4 29.1,22 27.4,22 27,22.4 25.7,22.4 v25.5,22.6 | v34.2,23.2 34.2,23.6 34.4,23.8 41.5,23.8 v41.9,23.4
DO19  (via drill 0.51)
  Top 0.381: U19.3 v39.2,22.2 | v43.4,23.1 44.7,23.1 U20.4 47.5,22.2 v48.1,22.8 | v55.8,23.1 56,22.9 56,20.77 56,20.03 56,20.02 56,19.5 56.5,19 U21.6
  Bottom 0.381: v39.2,22.2 39.4,22 39.62,22 40.03,22.4 40.77,22.4 41.14,22.04 42.34,22.04 v43.4,23.1 | v48.1,22.8 48.1,23.4 48.3,23.6 55.3,23.6 v55.8,23.1
DO20  (via drill 0.51)
  Top 0.381: U20.3 52.58,22.2 v52.88,21.9 | v57,22.2 U21.4 61.8,22.2 62.2,22.6 v62.2,23.1 | v69.4,23.2 69.4,19.5 69.9,19 U22.6
  Bottom 0.381: v57,22.2 56.7,21.9 54.98,21.9 54.47,22.4 53.73,22.4 53.23,21.9 v52.88,21.9 | v62.2,23.1 62.79,23.7 68.9,23.7 v69.4,23.2
DO21  (via drill 0.51)
  Top 0.381: U21.3 64.42,22.32 v66.58,22.32 | v70.4,22.2 U22.4 75,22.2 v75.5,22.7 | v83.1,23 83.5,22.6 83.5,20.77 83.5,20.03 83.5,20.02 83.5,19.1 83.6,19 U23.6
  Bottom 0.381: v70.4,22.2 70.38,22.22 68.85,22.22 68.17,22.9 67.43,22.9 66.85,22.32 v66.58,22.32 | v75.5,22.7 75.5,23.2 75.8,23.5 82.6,23.5 v83.1,23
DO22  (via drill 0.51)
  Top 0.381: U22.3 78.1,22.1 v80.3,22.1 | v84.4,22.9 86,22.9 U23.4 88.6,22.2 v89.2,22.8 | v96.6,23.3 96.6,19.7 97.3,19 U24.6
  Bottom 0.381: v80.3,22.1 80.72,22.1 81.03,22.4 81.8,22.4 82.3,21.9 83.4,21.9 v84.4,22.9 | v89.2,22.8 89.2,23.5 89.4,23.7 96.2,23.7 v96.6,23.3
DO23  (via drill 0.51)
  Top 0.381: v98.2,21.69 98.71,22.2 U24.4 | v94,22.2 U23.3 90.55,22.2 v89.3,20.95 | v87.85,17.6 87.85,15.35 v86.9,14.4 | v57.8,14.35 55.4,11.95 51.2,11.95 v51.02,12.12 | v2.2,5.1 U25.6
  Bottom 0.381: v94,22.2 94.62,22.2 94.83,22.4 97.49,22.4 v98.2,21.69 | v89.3,20.95 88.15,20.95 87.85,20.65 v87.85,17.6 | v86.9,14.4 57.85,14.4 v57.8,14.35 | v51.02,12.12 50.71,12.44 3.34,12.44 2.35,11.45 2.35,5.35 2.2,5.2 v2.2,5.1
DO24  (via drill 0.51)
  Top 0.381: U24.3 108.1,22.2 108.2,22.1 108.2,13.9 v107.7,13.4 | v2.1,12.6 1.4,11.9 1.4,9 2.1,8.3 U25.4 6.5,8.3 v7.1,8.9 | v14.5,9.3 14.5,5.8 15.2,5.1 U26.6
  Bottom 0.381: v107.7,13.4 55.88,13.4 55.37,13.9 54.6,13.9 53.73,13.03 2.53,13.03 v2.1,12.6 | v7.1,8.9 7.1,9.6 7.4,9.9 13.9,9.9 v14.5,9.3
DO25  (via drill 0.51)
  Top 0.381: U25.3 11.78,8.3 v11.79,8.31 | v15.9,8.54 16.14,8.3 U26.4 20,8.3 v20.7,9 | v28.3,9.2 28.3,6.1 29.3,5.1 U27.6
  Bottom 0.381: v11.79,8.31 12.24,8.31 12.63,8.7 13.37,8.7 13.84,8.24 15.6,8.24 v15.9,8.54 | v20.7,9 20.7,9.8 20.9,10 27.5,10 v28.3,9.2
DO26  (via drill 0.51)
  Top 0.381: U26.3 25.3,8.3 v25.5,8.5 | v29.6,8.7 30,8.3 U27.4 33.8,8.3 v34.5,9 | v42.1,11 42.5,10.6 42.5,8.57 42.5,5.8 43.2,5.1 U28.6
  Bottom 0.381: v25.5,8.5 26.02,8.5 26.23,8.7 27.2,8.7 27.7,8.2 29.1,8.2 v29.6,8.7 | v34.5,9 34.5,9.7 34.8,10 39.5,10 40.5,11 v42.1,11
DO27  (via drill 0.51)
  Top 0.381: U27.3 v39.2,8.3 | v43.4,7.6 44.1,8.3 U28.4 47.8,8.3 48,8.1 48,4.6 48.9,3.7 56.6,3.7 57.3,4.4 57.3,4.7 57.7,5.1 U29.6
  Bottom 0.381: v39.2,8.3 39.73,8.3 40.03,8.6 40.77,8.6 41.19,8.19 42.81,8.19 v43.4,7.6
DO28  (via drill 0.51)
  Top 0.381: U28.3 U29.4 59.3,9.5 60,10.2 62.17,10.2 62.7,9.67 62.7,9.6 v64.2,9.6 | v65.9,3.89 65.9,3.7 66.3,3.3 72.3,3.3 73,4 U30.6
  Bottom 0.381: v65.9,3.89 65.9,7.9 v64.2,9.6
DO29  (via drill 0.51)
  Top 0.381: U29.3 64.9,8.3 v66.1,9.5 | v71,9.8 71,8.4 71.1,8.3 U30.4 75.1,8.3 v75.5,8.7 | v83.2,9.3 83.2,5.8 83.9,5.1 U31.6
  Bottom 0.381: v66.1,9.5 66.1,10.2 66.7,10.8 70,10.8 v71,9.8 | v75.5,8.7 75.5,9.3 75.8,9.6 82.9,9.6 v83.2,9.3
DO30  (via drill 0.51)
  Top 0.381: U30.3 80.4,8.3 v80.5,8.4 | v84.4,8.6 84.7,8.3 U31.4 88.9,8.3 89.3,8.7 v89.3,8.9 | v96.29,9.8 95.97,9.48 95.97,8.2 96.1,8.07 96.1,7.33 95.97,7.2 95.97,5.53 96.4,5.1 U32.6
  Bottom 0.381: v84.4,8.6 84.2,8.4 82.17,8.4 81.97,8.6 81.23,8.6 81.03,8.4 v80.5,8.4 | v89.3,8.9 89.3,9.4 89.7,9.8 v96.29,9.8
GND  (via drill 0.51)
  Top 0.762: U29.5 59,7 v56.5,7
  other vias: 2.3,14.55 16.55,17.15 3.5,45.45 96.55,25.35
  pour Bottom: 1,1 109,1 109,54 1,54
  pour Top: 1,54 1,1 109,1 109,54
N$1  (via drill 0.51)
  Top 0.381: U1.1 11.3,46.7 11.71,46.29 v11.71,44.55
  Bottom 0.762: C1.1 10.36,44.55 v11.71,44.55 13.05,45.89 R1.1
N$3  (via drill 0.51)
  Top 0.381: U2.1 23.3,46.6 25,46.6 25.35,46.25 v25.35,44.74
  Bottom 0.762: C2.1 v25.35,44.74 R2.1
N$5  (via drill 0.51)
  Top 0.381: U3.1 38.6,46.7 39.14,46.16 v39.14,44.49
  Bottom 0.762: R3.1 40.44,45.79 v39.14,44.49 37.86,44.49 C3.1
N$7  (via drill 0.51)
  Top 0.381: U4.1 52.3,46.7 52.74,46.26 v52.74,44.74
  Bottom 0.762: C4.1 v52.74,44.74 R4.1
N$9  (via drill 0.51)
  Top 0.381: U5.1 66,46.7 66.54,46.16 v66.54,44.59
  Bottom 0.762: R5.1 67.84,45.89 v66.54,44.59 65.26,44.59 C5.1
N$11  (via drill 0.51)
  Top 0.381: U6.1 79.7,46.7 80.14,46.26 v80.14,44.24
  Bottom 0.762: R6.1 81.49,45.59 v80.14,44.24 79.16,44.24 C6.1
N$13  (via drill 0.51)
  Top 0.381: U7.1 93.4,46.7 93.84,46.26 v93.84,44.69
  Bottom 0.762: C7.1 v93.84,44.69 R7.1
N$15  (via drill 0.51)
  Top 0.381: U8.1 105.5,44.26 105.12,43.88 v104.09,42.85
  Bottom 0.381: v104.09,42.85 104.15,42.85 104.77,43.47 105,43.7 | 105,43.7 | 105,43.7 105.96,44.66 C8.1 | 105,43.7
  Bottom 0.762: R8.1 106.79,44.59 C8.1
N$18  (via drill 0.51)
  Top 0.381: U17.1 v7.2,19
  Bottom 0.381: 10,19 10.4,19
  Bottom 0.406: R17.1 12.6,19 10,19 v7.2,19
  Bottom 0.61: C17.1 11.32,16.06 R17.1
N$19  (via drill 0.51)
  Top 0.381: v20.9,19.1 23.1,19.1 U18.1
  Bottom 0.381: 25.79,17.32 24,19.1 v20.9,19.1
  Bottom 0.762: C18.1 25.48,17.01 25.79,17.32 R18.1
N$21  (via drill 0.51)
  Top 0.381: U19.1 v34.6,19
  Bottom 0.381: v34.6,19 38.2,19 39.58,17.62 39.58,17.32
  Bottom 0.762: C19.1 39.21,16.96 39.58,17.32 R19.1
N$23  (via drill 0.51)
  Top 0.381: v10.8,37.35 10.44,36.99 7.84,36.99 7.6,36.76 7.6,33 7.7,32.9 U9.1
  Bottom 0.381: 14.02,29.88 R9.1 12.88,32.07 12.26,32.69 12.26,33.6 11.93,33.93 10.8,35.06 v10.8,37.35
  Bottom 0.762: C9.1 14.02,29.88
N$24  (via drill 0.51)
  Top 0.381: U10.1 25,32.9 25.46,32.44 v25.46,30.85
  Bottom 0.762: C10.1 v25.46,30.85 R10.1
N$26  (via drill 0.51)
  Top 0.381: U11.1 38.8,32.9 39.29,32.41 v39.29,30.7
  Bottom 0.762: R11.1 40.4,31.81 v39.29,30.7 37.72,30.7 C11.1
N$28  (via drill 0.51)
  Top 0.381: U12.1 52.4,32.9 52.82,32.48 v52.82,30.85
  Bottom 0.762: C12.1 v52.82,30.85 R12.1
N$30  (via drill 0.51)
  Top 0.381: U13.1 65.9,32.9 66.55,32.25 v66.55,30.9
  Bottom 0.762: C13.1 v66.55,30.9 R13.1
N$32  (via drill 0.51)
  Top 0.381: U14.1 78.1,32.8 79.8,32.8 80.31,32.29 v80.31,30.8
  Bottom 0.762: R14.1 80.26,30.8 v80.31,30.8 78.95,30.8 C14.1
N$34  (via drill 0.51)
  Top 0.381: U15.1 93.5,32.9 94.04,32.36 v94.04,30.7
  Bottom 0.762: C15.1 92.84,30.7 v94.04,30.7 95.25,31.91 R15.1
N$36  (via drill 0.51)
  Top 0.381: v107.3,31.75 106.65,31.75 U16.1
  Bottom 0.381: 99.93,38.53 100.46,38 105,38 108.26,34.74 108.26,32.56 107.89,32.19 107.73,32.19 v107.3,31.75
  Bottom 0.762: R16.1 98.8,38.93 99.2,38.53 99.93,38.53 | C16.1 100.67,39.27 99.93,38.53 | 99.93,38.53
N$38  (via drill 0.51)
  Top 0.381: U20.1 v48.3,19
  Bottom 0.381: v48.3,19 51.6,19 53.27,17.34
  Bottom 0.762: C20.1 52.89,16.96 53.27,17.34 R20.1
N$40  (via drill 0.51)
  Top 0.381: U21.1 v62,19
  Bottom 0.381: v62,19 65,19 66.75,17.25
  Bottom 0.762: C21.1 66.47,16.96 66.75,17.25 R21.1
N$42  (via drill 0.51)
  Top 0.381: U22.1 v75.6,19
  Bottom 0.381: v75.6,19 78.9,19 80.46,17.44 80.46,17.24
  Bottom 0.762: C22.1 80.18,16.96 80.46,17.24 R22.1
N$44  (via drill 0.51)
  Top 0.381: U23.1 v89.4,19
  Bottom 0.381: 94.3,17.3 92.6,19 v89.4,19
  Bottom 0.762: C23.1 93.96,16.96 94.3,17.3 R23.1
N$46  (via drill 0.51)
  Top 0.381: U24.1 v103.1,19
  Bottom 0.381: v103.1,19 103.1,15.35 C24.1
  Bottom 0.762: C24.1 101.04,15.14 R24.1
N$48  (via drill 0.51)
  Top 0.381: U25.1 v7.15,5.1
  Bottom 0.381: v7.15,5.1 U25.1 10.1,4.5 C25.1
  Bottom 0.762: C25.1 10.17,3 11.9,3 12.94,4.04 R25.1
N$49  (via drill 0.51)
  Top 0.381: U26.1 v20.85,5.1
  Bottom 0.381: C26.1 23.79,4.51 U26.1 v20.85,5.1
  Bottom 0.762: C26.1 25.57,3.07 26.62,4.12 R26.1
N$51  (via drill 0.51)
  Top 0.381: U27.1 v34.6,5.1
  Bottom 0.381: v34.6,5.1 36.1,5.1 37.3,5.1 37.7,4.7 37.7,3.06 C27.1
  Bottom 0.762: C27.1 39.48,3.02 39.5,3 40.42,3.92 R27.1
N$53  (via drill 0.51)
  Top 0.381: U28.1 48.9,5.1 48.7,5.3 48.7,15.1 v48,15.8
  Bottom 0.381: v48,15.8 48,14.25 R28.1
  Bottom 0.762: R28.1 50.59,14.22 C28.1
N$55  (via drill 0.51)
  Top 0.381: U29.1 69.1,5.1 v69.5,5.5
  Bottom 0.381: C29.1 68.74,4.74 v69.5,5.5
  Bottom 0.762: C29.1 67.78,7.31 R29.1
N$57  (via drill 0.51)
  Top 0.381: U30.1 v75.6,5.1
  Bottom 0.381: v75.6,5.1 U30.1 78.73,4.37 C30.1
  Bottom 0.762: C30.1 80.98,3.02 81,3 81.57,3.57 R30.1
N$59  (via drill 0.51)
  Top 0.381: U31.1 v89.4,5.1
  Bottom 0.381: v89.4,5.1 U31.1 92.42,4.38 C31.1
  Bottom 0.762: C31.1 94.18,3.12 94.2,3.1 94.6,3.1 95.17,3.67 R31.1
N$61  (via drill 0.51)
  Top 0.381: v105.05,3.45 105.5,3.9 U32.1
  Bottom 0.381: C32.1 104.77,3.17 v105.05,3.45 106.42,4.82 R32.1

### Text on the board
bPlace: 8x4 LED Board v1.0 | Kala | Designed in Canada by K.K. // 2018-08-12 | DATA / OUT | DATA / IN | POWER